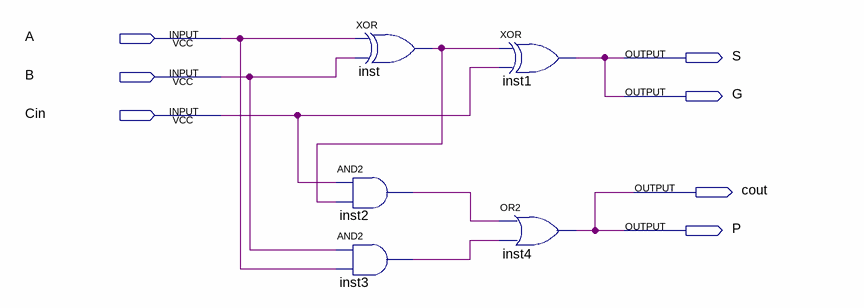
[diagram p0: schematic sheet]
// Quartus schematic onebitadder.bdf as structural Verilog: 5 symbols, 7 pins
module onebitadder (
  input  A,
  input  B,
  input  Cin,
  output S,
  output G,
  output cout,
  output P
);

  wire inst2_out, inst3_out, inst_out;

  xor inst (inst_out, A, B);
  and inst2 (inst2_out, Cin, inst_out);
  and inst3 (inst3_out, B, A);
  xor inst1 (G, inst_out, Cin);
  or inst4 (cout, inst2_out, inst3_out);

  assign P = cout;
  assign S = G;
endmodule
